# EAGLE design leg bridge (EAGLE 9.6.2)
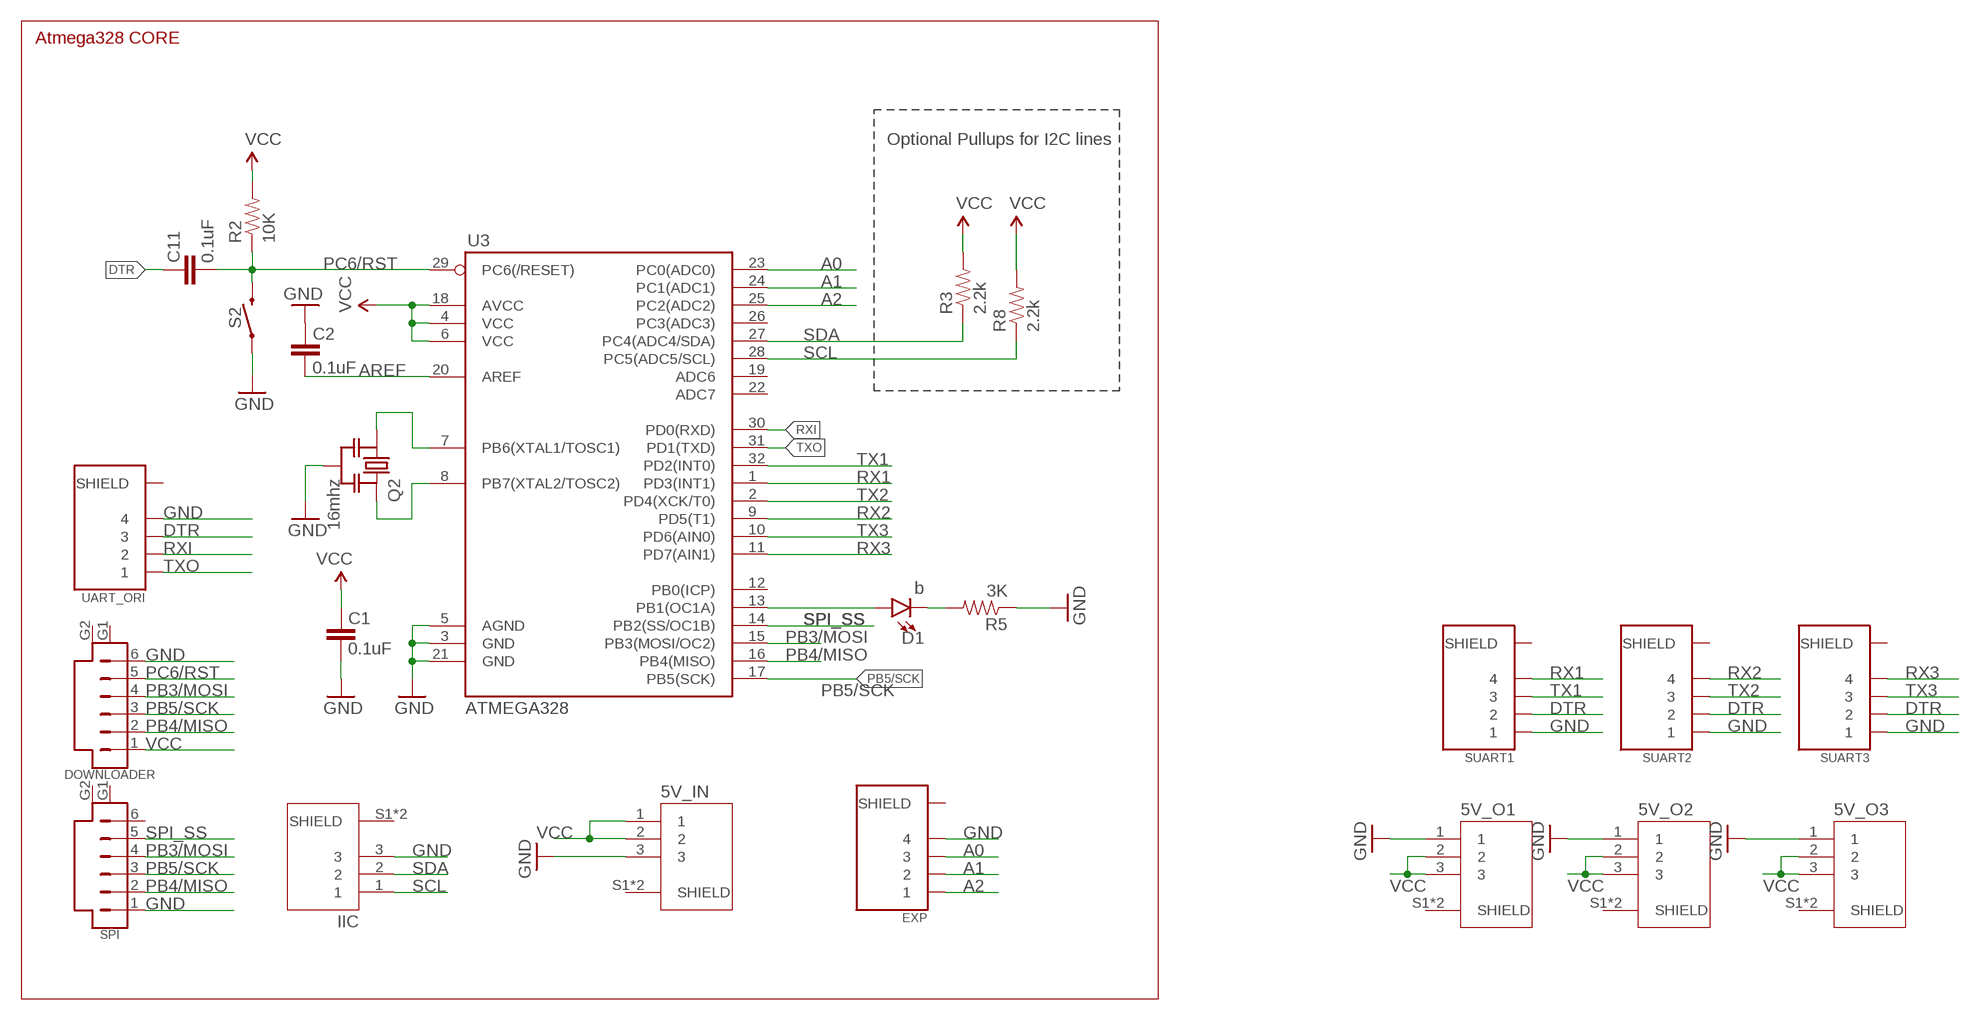
[diagram p0: schematic, sheet 1]

## Parts
5V_IN  SM03B-SRSS-TB(LF)(SN)  [JST_SM03B-SRSS-TB(LF)(SN)]
5V_O1  SM03B-SRSS-TB(LF)(SN)  [JST_SM03B-SRSS-TB(LF)(SN)]
5V_O2  SM03B-SRSS-TB(LF)(SN)  [JST_SM03B-SRSS-TB(LF)(SN)]
5V_O3  SM03B-SRSS-TB(LF)(SN)  [JST_SM03B-SRSS-TB(LF)(SN)]
C1  0.1uF  CAP0603-CAP  [0603-CAP]
C2  0.1uF  CAP0603-CAP  [0603-CAP]
C11  0.1uF  CAP0603-CAP  [0603-CAP]
D1  b  LED0603  [LED-0603]
DOWNLOADER  SM06B-SRSS-TB  [SM06B]
EXP  SM04B-SRSS-TB(LF)(SN)  [JST_SM04B-SRSS-TB(LF)(SN)]
IIC  SM03B-SRSS-TB(LF)(SN)  [JST_SM03B-SRSS-TB(LF)(SN)]
Q2  16mhz  RESONATOR-MURATACST_CE  [RESONATOR_MURATA2]
R2  10K  RESISTOR0603-RES  [0603-RES]
R3  2.2k  RESISTOR0603-RES  [0603-RES]
R5  3K  RESISTOR0603-RES  [0603-RES]
R8  2.2k  RESISTOR0603-RES  [0603-RES]
S2  MOMENTARY-SWITCH-SPST-SMD-RIGHT-ANGLE  [TACTILE_SWITCH_SMD_RIGHT_ANGLE]
SPI  SM06B-SRSS-TB  [SM06B]
SUART1  SM04B-SRSS-TB(LF)(SN)  [JST_SM04B-SRSS-TB(LF)(SN)]
SUART2  SM04B-SRSS-TB(LF)(SN)  [JST_SM04B-SRSS-TB(LF)(SN)]
SUART3  SM04B-SRSS-TB(LF)(SN)  [JST_SM04B-SRSS-TB(LF)(SN)]
U3  ATMEGA328  ATMEGA168  [TQFP32-08]
UART_ORI  SM04B-SRSS-TB(LF)(SN)  [JST_SM04B-SRSS-TB(LF)(SN)]

## Nets
A0: EXP.3 U3.23(PC0(ADC0))
A1: EXP.2 U3.24(PC1(ADC1))
A2: EXP.1 U3.25(PC2(ADC2))
AREF: C2.1 U3.20(AREF)
DTR: C11.2 SUART1.2 SUART2.2 SUART3.2 UART_ORI.3
GND: 5V_IN.3 5V_O1.1 5V_O2.1 5V_O3.1 C1.1 C2.2 DOWNLOADER.6 EXP.4 IIC.3 Q2.2 R5.1 S2.1 SPI.1 SUART1.1 SUART2.1 SUART3.1 U3.3(GND) U3.5(AGND) U3.21(GND) UART_ORI.4
N$1: Q2.1 U3.7(PB6(XTAL1/TOSC1))
N$2: Q2.3 U3.8(PB7(XTAL2/TOSC2))
N$3: D1.A U3.13(PB1(OC1A))
N$7: D1.C R5.2
PB3/MOSI: DOWNLOADER.4 SPI.4 U3.15(PB3(MOSI/OC2))
PB4/MISO: DOWNLOADER.2 SPI.2 U3.16(PB4(MISO))
PB5/SCK: DOWNLOADER.3 SPI.3 U3.17(PB5(SCK))
PC6/RST: C11.1 DOWNLOADER.5 R2.1 S2.2 U3.29(PC6(/RESET))
RX1: SUART1.4 U3.1(PD3(INT1))
RX2: SUART2.4 U3.9(PD5(T1))
RX3: SUART3.4 U3.11(PD7(AIN1))
RXI: U3.30(PD0(RXD)) UART_ORI.2
SCL: IIC.1 R8.1 U3.28(PC5(ADC5/SCL))
SDA: IIC.2 R3.1 U3.27(PC4(ADC4/SDA))
SPI_SS: SPI.5 U3.14(PB2(SS/OC1B))
TX1: SUART1.3 U3.32(PD2(INT0))
TX2: SUART2.3 U3.2(PD4(XCK/T0))
TX3: SUART3.3 U3.10(PD6(AIN0))
TXO: U3.31(PD1(TXD)) UART_ORI.1
VCC: 5V_IN.1 5V_IN.2 5V_O1.2 5V_O1.3 5V_O2.2 5V_O2.3 5V_O3.2 5V_O3.3 C1.2 DOWNLOADER.1 R2.2 R3.2 R8.2 U3.4(VCC) U3.6(VCC) U3.18(AVCC)
Unconnected: 5V_IN.S1(SHIELD) 5V_IN.S2(SHIELD) 5V_O1.S1(SHIELD) 5V_O1.S2(SHIELD) 5V_O2.S1(SHIELD) 5V_O2.S2(SHIELD) 5V_O3.S1(SHIELD) 5V_O3.S2(SHIELD) DOWNLOADER.G1 DOWNLOADER.G2 EXP.S1(SHIELD) EXP.S2(SHIELD) IIC.S1(SHIELD) IIC.S2(SHIELD) SPI.6 SPI.G1 SPI.G2 SUART1.S1(SHIELD) SUART1.S2(SHIELD) SUART2.S1(SHIELD) SUART2.S2(SHIELD) SUART3.S1(SHIELD) SUART3.S2(SHIELD) U3.12(PB0(ICP)) U3.19(ADC6) U3.22(ADC7) U3.26(PC3(ADC3)) UART_ORI.S1(SHIELD) UART_ORI.S2(SHIELD)

## Notes on the sheet
- Atmega328 CORE
- Optional Pullups for I2C lines

## Library data of the parts
5V_IN 5V_O1-5V_O3 IIC = SM03B-SRSS-TB_LF__SN_:SM03B-SRSS-TB(LF)(SN): SH Series 3 Position 1 mm Pitch Surface Mount Side Entry Shrouded Header; AVAILABILITY: Unavailable; DESCRIPTION: Connector Header Surface Mount, Right Angle 3 position 0.039 _1.00mm_; MF: JST Sales; MP: SM03B-SRSS-TB_LF__SN_; PACKAGE: None; PRICE: None
C1 C2 C11 = SparkFun:CAP: Capacitor Standard 0603 ceramic capacitor, and 0.1" leaded capacitor.
D1 = SparkFun-LED:LED: LED (Generic) Standard schematic elements and footprints for 5mm, 3mm, 1206, and 0603 sized LEDs. Generic LEDs with no color specified.
DOWNLOADER SPI = SM06B-SRSS-TB:SM06B-SRSS-TB: CONN HEADER SH 6POS SIDE 1MM TIN Check prices <https://snapeda.com/parts/SM06B-SRSS-TB/JST%20Sales/view-part/?ref=eda>; AVAILABILITY: Bad; DESCRIPTION: Connector Header Surface Mount, Right Angle 6 position 0.039 (1.00mm); MF: JST Sales; MP: SM06B-SRSS-TB; PACKAGE: None; PRICE: None
EXP SUART1-SUART3 UART_ORI = SM04B-SRSS-TB_LF__SN_:SM04B-SRSS-TB(LF)(SN): SH Series 1.0 mm Pitch 2 Position Single Row Side Entry Shrouded Header Check prices <https://snapeda.com/parts/SM04B-SRSS-TB%28LF%29%28SN%29/JST%20Sales/view-part/?ref=eda>; ARROW_EUROPE-PURCHASE-URL: https://snapeda.com/shop?store=Arrow+Europe&id=557466; AVAILABILITY: Good; DESCRIPTION: Connector Header Surface Mount, Right Angle 4 position 0.039 (1.00mm); DIGIKEY-PURCHASE-URL: https://snapeda.com/shop?store=DigiKey&id=557466; MF: JST Sales; MP: SM04B-SRSS-TB(LF)(SN); PACKAGE: None; PRICE: None
Q2 = m-pad-2.1:RESONATOR-MURATA: Murata ceramic Resonator "ceralock" CSTCE series with built in load capacitance +- 0.5% tolerance 12.51MHz to 19.99MHz 16MHz murata part#: CSTCE16M0V53-R0 16MHz digikey part#: 490-1198-1-ND $1.33 each
R2 R3 R5 R8 = SparkFun:RESISTOR: Resistor Basic schematic elements and footprints for 0603, 1206, and PTH resistors.
S2 = SparkFun-Switches:MOMENTARY-SWITCH-SPST: Momentary Switch (Pushbutton) - SPST Normally-open (NO) SPST momentary switches (buttons, pushbuttons). Variants PTH-12MM - 12mm square, through-hole Momentary Pushbutton Switch - 12mm Square <https://www.sparkfun.com/products/9190> (COM-09190) PTH-6.0MM, PTH-6.0MM-KIT - 6.0mm square, through-hole Mini Pushbutton Switch <https://www.sparkfun.com/products/97> (COM-00097) KIT package intended for soldering kit's - only one side of pads' copper is exposed. PTH-RIGHT-ANGLE-KIT - Right-angle, through-hole Right Angle Tactile Button <https://www.sparkfun.com/products/10791> - Used on SparkFun BigTime Watch Kit <https://www.sparkfun.com/products/11734> SMD-12MM - 12mm square, surface-mount Tactile Button - SMD (12mm) <https://www.sparkfun.com/products/12993> (COM-12993) Used on SparkFun PicoBoard <https://www.sparkfun.com/products/11888> SMD-4.5MM - 4.5mm Square Trackball Switch Used on SparkFun Blackberry Trackballer Breakout <https://www.sparkfun.com/products/13169> SMD-4.6MMX2.8MM - 4.60mm x 2.80mm, surface mount Used on SparkFun SAMD21 Mini Breakout <https://www.sparkfun.com/products/13664> SMD-5.2MM, SMD-5.2-REDUNDANT - 5.2mm square, surface-mount Mini Pushbutton Switch - SMD <https://www.sparkfun.com/products/8720> (COM-08720) Used on Arduino Pro Mini <https://www.sparkfun.com/products/11114> REDUNDANT package connects both switch circuits together SMD-6.0X3.5MM - 6.0 x 3.5mm, surface mount Momentary Reset Switch SMD <https://www.sparkfun.com/products/8229> (COM-08229) SMD-6.2MM-TALL - 6.2mm square, surface mount Tactile Button - SMD (6mm) <https://www.sparkfun.com/products/12992> Used on SparkFun Digital Sandbox <https://www.sparkfun.com/products/12651> SMD-RIGHT-ANGLE - Right-angle, surface mount Used on SparkFun Block for Intel® Edison - Arduino <https://www.sparkfun.com/products/13036>; PROD_ID: COMP-12265
U3 = SparkFun:ATMEGA168

## Net classes
0 default: width 0.203 mm
1 vcc: width 0.254 mm

## Board
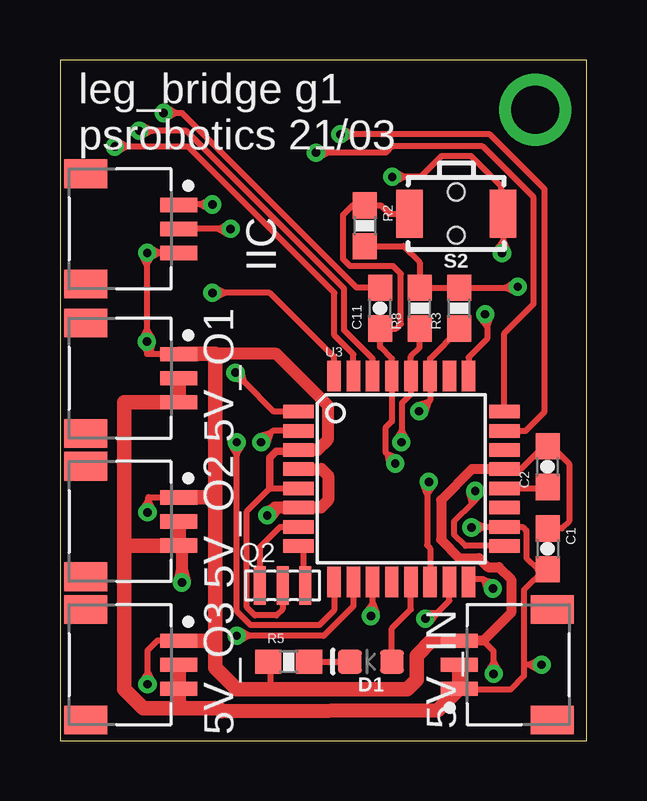
[diagram p1: board, top side]
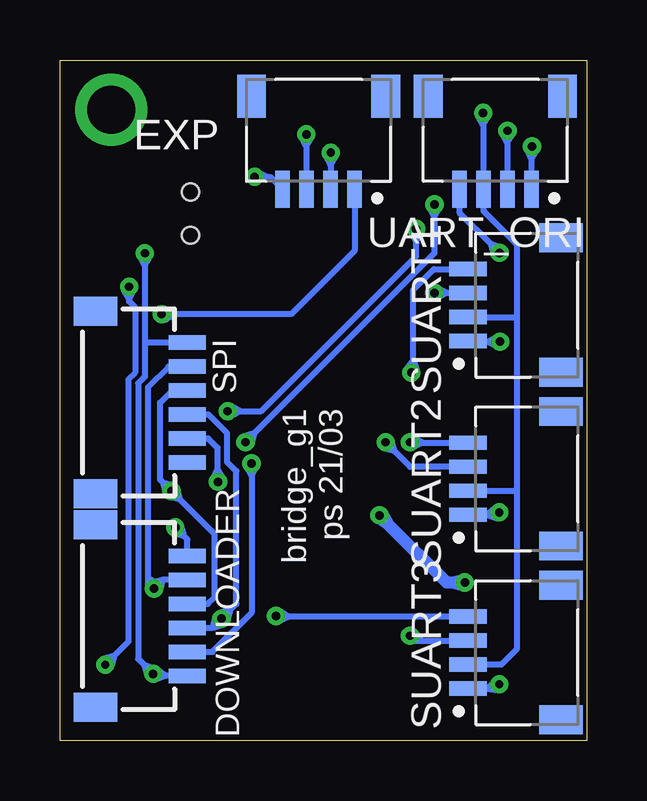
[diagram p2: board, bottom side, seen from below]

Size 21.95 x 28.37 mm. Coordinates in mm from the lower left corner, seen from the top.
Outline: 0,0 21.95,0 21.95,28.37 0,28.37 0,0
Copper layers (1*16): Top 0.035mm / dielectric 1.5mm / Bottom 0.035mm
Design rules "default *": minimum track width 6mil, minimum drill 0.35mm, track to track 6mil, track to pad 6mil, pad to pad 6mil, via to via 6mil, smd to smd 6mil, copper to edge 5mil, drill to drill 6mil, minimum pad ring 10mil, minimum via ring 8mil, stop-mask expansion 4mil, vias tented up to drill 20mil, thermal gap 10mil

### Footprints (pad centres in the part's own frame; a part is rotated, then mirrored left to right if it is on the bottom)
JST_SM03B-SRSS-TB(LF)(SN) = smd 0.6 x 1.55: 1 -1,0; 2 0,0; 3 1,0 | smd 1.2 x 1.8: S1 -2.3,-3.875; S2 2.3,-3.875
0603-CAP = smd 1.1 x 1: 1 -0.85,0; 2 0.85,0
LED-0603 = smd 1 x 1: A -0.877,0; C 0.877,0
SM06B = smd 0.6 x 1.55: 1 -2.5,2.275; 2 -1.5,2.275; 3 -0.5,2.275; 4 0.5,2.275; 5 1.5,2.275; 6 2.5,2.275 | smd 1.2 x 1.8: G1 -3.8,-1.55; G2 3.8,-1.55
JST_SM04B-SRSS-TB(LF)(SN) = smd 0.6 x 1.55: 1 -1.5,0; 2 -0.5,0; 3 0.5,0; 4 1.5,0 | smd 1.2 x 1.8: S1 -2.8,-3.875; S2 2.8,-3.875
RESONATOR_MURATA2 = smd 0.5 x 1.6: 1 -0.95,0; 2 0,0; 3 0.95,0
0603-RES = smd 1.1 x 1: 1 -0.85,0; 2 0.85,0
TACTILE_SWITCH_SMD_RIGHT_ANGLE = smd 1.1 x 2: 1 -1.95,0; 2 1.95,0 | hole 0.7: 0,0.9; 0,-0.9
TQFP32-08 = smd 1.27 x 0.559: 1 -4.293,2.8; 2 -4.293,2; 3 -4.293,1.2; 4 -4.293,0.4; 5 -4.293,-0.4; 6 -4.293,-1.2; 7 -4.293,-2; 8 -4.293,-2.8; 17 4.293,-2.8; 18 4.293,-2; 19 4.293,-1.2; 20 4.293,-0.4; 21 4.293,0.4; 22 4.293,1.2; 23 4.293,2; 24 4.293,2.8 | smd 0.559 x 1.27: 9 -2.8,-4.293; 10 -2,-4.293; 11 -1.2,-4.293; 12 -0.4,-4.293; 13 0.4,-4.293; 14 1.2,-4.293; 15 2,-4.293; 16 2.8,-4.293; 25 2.8,4.293; 26 2,4.293; 27 1.2,4.293; 28 0.4,4.293; 29 -0.4,4.293; 30 -1.2,4.293; 31 -2,4.293; 32 -2.8,4.293

### Placement (x,y rotation side)
5V_IN  16.64,3.17 90 top
5V_O1  4.95,15.11 270 top
5V_O2  4.95,9.14 270 top
5V_O3  4.95,3.17 270 top
C1  20.32,8 270 top
C2  20.32,11.43 90 top
C11  13.34,18.03 90 top
D1  12.95,3.3 180 top
DOWNLOADER  18.92,5.21 270 bottom
EXP  11.18,22.99 180 bottom
IIC  4.95,21.34 270 top
Q2  9.27,6.48 0 top
R2  12.7,21.46 270 top
R3  16.64,18.03 90 top
R5  9.53,3.3 0 top
R8  14.99,18.03 90 top
S2  16.51,21.97 180 top
SPI  18.92,14.1 270 bottom
SUART1  4.95,18.16 90 bottom
SUART2  4.95,10.92 90 bottom
SUART3  4.95,3.68 90 bottom
U3  14.22,10.92 0 top
UART_ORI  3.81,22.99 180 bottom

### Tracks (layer width: path | path; a pad name or v marks a point on that pad's centre or on a via)
A0  (via drill 0.35)
  Top 0.254: U3.23 19.4,12.92 20.19,13.72 20.19,22.99 17.91,25.27 12.21,25.27 | 12.21,25.27 v11.68,25.27 | 12.21,25.27 11.8,25.49 | 11.8,25.49 | v11.68,25.27 11.8,25.49 | 12.21,25.27 11.8,25.05 | v11.68,25.27 11.8,25.05 | 12.21,25.27 11.8,25.49 | v11.68,25.27 11.8,25.49 | 12.21,25.27 11.8,25.05 | v11.68,25.27 11.8,25.05
  Bottom 0.254: v11.68,25.27 11.68,24.75 | 11.68,24.75 EXP.3 | 11.68,24.75 11.9,25.15 | 11.9,25.15 | v11.68,25.27 11.9,25.15 | 11.68,24.75 11.46,25.15 | v11.68,25.27 11.46,25.15 | 11.68,24.75 11.9,25.15 | v11.68,25.27 11.9,25.15 | 11.68,24.75 11.46,25.15 | v11.68,25.27 11.46,25.15
A1  (via drill 0.35)
  Top 0.254: U3.24 18.52,16.99 19.73,18.21 19.73,22.65 17.61,24.77 13.85,24.77 13.59,24.51 11.19,24.51 | 11.19,24.51 v10.67,24.51 | 11.19,24.51 10.79,24.73 | 10.79,24.73 | v10.67,24.51 10.79,24.73 | 11.19,24.51 10.79,24.29 | v10.67,24.51 10.79,24.29 | 11.19,24.51 10.79,24.73 | v10.67,24.51 10.79,24.73 | 11.19,24.51 10.79,24.29 | v10.67,24.51 10.79,24.29
  Bottom 0.254: v10.67,24.51 v10.68,24.5 10.68,23.99 | 10.68,23.99 EXP.2 | 10.68,23.99 10.89,24.39 v10.67,24.51 | 10.68,23.99 10.45,24.39 v10.67,24.51
A2  (via drill 0.35)
  Top 0.254: v17.72,17.78 17.8,17.7 17.8,17.26 | 17.8,17.26 17.8,16.75 17.02,15.98 U3.25 | 17.8,17.26 17.95,17.7 v17.72,17.78 | 17.8,17.26 17.52,17.63 v17.72,17.78
  Bottom 0.254: EXP.1 9.68,20.42 12.32,17.78 17.13,17.78 | 17.13,17.78 17.19,17.78 | 17.19,17.78 v17.72,17.78 | 17.13,17.78 17.19,17.75 | 17.19,17.75 17.53,17.56 17.58,17.53 17.6,17.56 | 17.13,17.78 17.19,17.82 | 17.19,17.82 17.58,18.03 17.6,18 | 17.19,17.78 17.6,17.56 | v17.72,17.78 17.6,17.56 | 17.19,17.78 17.6,18 | v17.72,17.78 17.6,18 | 17.19,17.75 17.61,17.55 v17.72,17.78 | 17.19,17.75 17.58,17.99 v17.72,17.78 | 17.19,17.82 17.58,17.57 v17.72,17.78 | 17.19,17.82 17.61,18.01 v17.72,17.78
AREF
  Top 0.254: U3.20 20.26,10.52 C2.1
DTR  (via drill 0.35)
  Top 0.254: C11.2 12.36,18.88 5.09,26.16 4.84,26.16 | 4.84,26.16 v4.32,26.16 | 4.84,26.16 4.44,26.38 | 4.44,26.38 | v4.32,26.16 4.44,26.38 | 4.84,26.16 4.44,25.94 | v4.32,26.16 4.44,25.94 | 4.84,26.16 4.44,26.38 | v4.32,26.16 4.44,26.38 | 4.84,26.16 4.44,25.94 | v4.32,26.16 4.44,25.94
  Bottom 0.254: v4.32,26.16 4.32,25.64 | 4.32,25.64 UART_ORI.3 4.31,22.09 2.92,20.7 2.92,17.65 | 2.92,17.65 2.92,10.41 | 2.92,10.41 2.92,3.81 3.56,3.17 SUART3.2 | SUART2.2 2.93,10.42 2.92,10.41 | SUART1.2 2.93,17.66 2.92,17.65 | 4.32,25.64 4.54,26.04 | 4.54,26.04 | v4.32,26.16 4.54,26.04 | 4.32,25.64 4.1,26.04 | v4.32,26.16 4.1,26.04 | 4.32,25.64 4.54,26.04 | v4.32,26.16 4.54,26.04 | 4.32,25.64 4.1,26.04 | v4.32,26.16 4.1,26.04
GND  (via drill 0.35)
  Top 0.254: C1.1 20.92,8.85 21.21,9.14 21.21,11.56 20.49,12.28 C2.2 20.15,12.28 19.2,11.32 U3.21 | Q2.2 9.27,5.49 9.02,5.23 8.12,5.23 7.79,5.56 7.79,9.57 8.74,10.52 U3.5 | R5.1 8.76,3.21 8.76,2.16 | v18.07,2.79 18.07,3.32 | 18.07,3.32 18.07,3.74 17.64,4.17 | 14.37,23.5 15.03,23.5 15.89,24.36 17.13,24.36 18.38,23.11 18.38,22.05 S2.1 18.46,20.84 | 14.37,23.5 v13.84,23.5 | 18.46,20.84 18.46,20.36 v18.41,20.32 | v3.62,16.64 3.62,16.13 3.75,16.13 | 3.75,16.13 4.97,16.13 | v3.65,9.53 3.68,9.56 3.68,10.05 | 3.68,10.05 3.68,10.16 4.97,10.16 | v3.65,2.36 3.65,2.88 | 3.65,2.88 3.65,3.77 4.06,4.19 4.94,4.19 5V_O3.1 | 3.62,19.81 3.62,20.34 v3.63,20.34 | 3.62,19.81 3.62,17.16 | 3.62,17.16 v3.62,16.64 | IIC.3 4.16,20.34 | 4.16,20.34 v3.63,20.34 | 18.07,3.32 | 18.07,3.32 | 18.07,3.32 18.29,2.91 | 18.07,3.32 17.85,2.91 | 17.85,2.91 | v18.07,2.79 17.85,2.91 | 18.07,3.32 18.29,2.91 | v18.07,2.79 18.29,2.91 | 18.07,3.32 17.85,2.91 | v18.07,2.79 17.85,2.91 | 18.07,3.32 18.29,2.91 | v18.07,2.79 18.29,2.91 | 14.37,23.5 13.96,23.72 | 13.96,23.72 | v13.84,23.5 13.96,23.72 | 14.37,23.5 13.96,23.28 | v13.84,23.5 13.96,23.28 | 14.37,23.5 13.96,23.72 | v13.84,23.5 13.96,23.72 | 14.37,23.5 13.96,23.28 | v13.84,23.5 13.96,23.28 | 18.46,20.84 18.21,20.46 v18.41,20.32 | 18.46,20.84 18.64,20.42 v18.41,20.32 | 3.62,17.16 | 3.62,17.16 | 3.62,17.16 3.84,16.76 | 3.75,16.13 3.86,16.58 v3.62,16.64 | 3.75,16.13 3.44,16.46 v3.62,16.64 | 3.62,17.16 3.4,16.76 | 3.4,16.76 | v3.62,16.64 3.4,16.76 | 3.62,17.16 3.84,16.76 | v3.62,16.64 3.84,16.76 | 3.62,17.16 3.4,16.76 | v3.62,16.64 3.4,16.76 | 3.62,17.16 3.84,16.76 | v3.62,16.64 3.84,16.76 | 3.68,10.05 3.44,9.66 v3.65,9.53 | 3.68,10.05 3.88,9.63 v3.65,9.53
  Top 0.254: 3.65,2.88 | 3.65,2.88 | 3.65,2.88 3.87,2.48 | 3.65,2.88 3.43,2.48 | 3.43,2.48 | v3.65,2.36 3.43,2.48 | 3.65,2.88 3.87,2.48 | v3.65,2.36 3.87,2.48 | 3.65,2.88 3.43,2.48 | v3.65,2.36 3.43,2.48 | 3.65,2.88 3.87,2.48 | v3.65,2.36 3.87,2.48 | 3.62,19.81 3.85,20.21 v3.63,20.34 | 3.62,19.81 3.41,20.22 v3.63,20.34 | 4.16,20.34 3.76,20.56 | 3.76,20.56 | v3.63,20.34 3.76,20.56 | 4.16,20.34 3.76,20.11 | v3.63,20.34 3.76,20.11 | 4.16,20.34 3.76,20.56 | v3.63,20.34 3.76,20.56 | 4.16,20.34 3.76,20.11 | v3.63,20.34 3.76,20.11
  Top 0.305: U3.3 9.87,12.06 9.02,12.06 8.74,11.79 8.74,10.52
  Top 0.406: U3.21 17.16,11.32 15.88,10.03 15.88,8.38 16.64,7.62 17.45,7.62 17.83,7.24 18.29,7.24 18.8,6.73 18.8,5.33 17.64,4.17 5V_IN.3
  Top 0.508: U3.3 10.72,12.12 11.18,12.57 11.18,13.97 9.01,16.13 6.48,16.13
  Top 0.61: 5V_IN.3 15.48,4.17 14.86,3.56 14.86,2.54 14.48,2.16 8.76,2.16 7.37,2.16 6.48,3.05 6.48,4.19 | 6.48,4.19 6.48,10.16 | 6.48,10.16 6.48,16.13 4.97,16.13 5V_O1.1 | 5V_O2.1 4.97,10.16 6.48,10.16 | 5V_O3.1 6.46,4.17 6.48,4.19
  Bottom 0.254: DOWNLOADER.6 17.55,2.71 | 17.55,2.71 17.98,2.71 v18.07,2.79 | v13.84,23.5 13.32,23.5 | 13.32,23.5 13.19,23.5 EXP.4 | v18.41,20.32 18.41,19.8 | 18.41,19.8 18.41,16.51 | 18.41,16.51 18.41,15.18 18.69,14.9 18.69,3.42 18.44,3.17 | 18.44,3.17 v18.07,2.79 | SPI.1 18.33,16.6 18.41,16.51 | SUART1.1 4.93,16.64 4.14,16.64 | 4.14,16.64 v3.62,16.64 | SUART2.1 4.16,9.42 | 4.16,9.42 3.75,9.42 v3.65,9.53 | SUART3.1 4.14,2.18 | 4.14,2.18 3.82,2.18 v3.65,2.36 | UART_ORI.4 5.31,22.01 4.01,20.71 | 4.01,20.71 v3.63,20.34 | 17.55,2.71 17.99,2.56 v18.07,2.79 | 17.55,2.71 17.91,2.99 v18.07,2.79 | 18.44,3.17 18,3.04 v18.07,2.79 | 18.44,3.17 18.31,2.72 v18.07,2.79 | 13.32,23.5 | 13.32,23.5 | 13.32,23.5 13.72,23.72 | 13.32,23.5 13.72,23.28 | 13.72,23.28 | v13.84,23.5 13.72,23.28 | 13.32,23.5 13.72,23.72 | v13.84,23.5 13.72,23.72 | 13.32,23.5 13.72,23.28 | v13.84,23.5 13.72,23.28 | 13.32,23.5 13.72,23.72 | v13.84,23.5 13.72,23.72 | 18.41,19.8 18.64,20.2 | 18.64,20.2 | v18.41,20.32 18.64,20.2 | 18.41,19.8 18.19,20.2 | v18.41,20.32 18.19,20.2 | 18.41,19.8 18.64,20.2 | v18.41,20.32 18.64,20.2 | 18.41,19.8 18.19,20.2 | v18.41,20.32 18.19,20.2 | 4.14,16.64 3.74,16.86 | 3.74,16.86 | v3.62,16.64 3.74,16.86 | 4.14,16.64 3.74,16.42 | v3.62,16.64 3.74,16.42 | 4.14,16.64 3.74,16.86 | v3.62,16.64 3.74,16.86 | 4.14,16.64 3.74,16.42 | v3.62,16.64 3.74,16.42 | 4.16,9.42 3.81,9.72 | v3.65,9.53 3.81,9.72 | 4.16,9.42 3.72,9.29 | v3.65,9.53 3.72,9.29 | 4.16,9.42 3.81,9.72 | v3.65,9.53 3.81,9.72 | 4.16,9.42 3.72,9.29 | v3.65,9.53 3.72,9.29 | 4.14,2.18 3.83,2.53 v3.65,2.36 | 4.14,2.18 3.69,2.11 v3.65,2.36 | 4.01,20.71 3.56,20.58 v3.63,20.34 | 4.01,20.71 3.88,20.27 v3.63,20.34
N$1
  Top 0.254: Q2.1 8.32,8.07 9.18,8.92 U3.7
N$2
  Top 0.254: Q2.3 10.16,6.54 10.16,7.89 U3.8
N$3
  Top 0.254: D1.A 13.83,4.69 14.62,5.48 U3.13
N$4  (via drill 2)
  other vias: 19.81,26.29
N$7
  Top 0.254: R5.2 D1.C
PB3/MOSI  (via drill 0.35)
  Top 0.254: 15.7,5.32 16.22,5.84 U3.15 | 15.7,5.32 15.48,5.1 v15.22,5.1 | 15.7,5.32 | 15.7,5.32 | 15.7,5.32 15.43,4.95 | 15.7,5.32 15.24,5.35 | 15.24,5.35 | v15.22,5.1 15.24,5.35 | 15.7,5.32 15.43,4.95 | v15.22,5.1 15.43,4.95 | 15.7,5.32 15.24,5.35 | v15.22,5.1 15.24,5.35 | 15.7,5.32 15.43,4.95 | v15.22,5.1 15.43,4.95
  Bottom 0.254: DOWNLOADER.4 15.61,4.71 15.6,4.72 | 15.6,4.72 v15.22,5.1 | 14.85,5.47 14.61,5.71 14.61,11.24 14.99,11.62 14.99,12.83 15.76,13.6 SPI.4 | 14.85,5.47 v15.22,5.1 | 15.6,4.72 15.46,5.17 v15.22,5.1 | 15.6,4.72 15.15,4.86 v15.22,5.1 | 14.85,5.47 14.98,5.03 v15.22,5.1 | 14.85,5.47 15.29,5.34 v15.22,5.1
PB4/MISO  (via drill 0.35)
  Top 0.254: U3.16 17.13,6.73 17.65,6.73 17.66,6.72 | v18.03,6.35 17.66,6.72 | 17.66,6.72 17.79,6.28 v18.03,6.35 | 17.66,6.72 18.11,6.59 v18.03,6.35
  Bottom 0.254: DOWNLOADER.2 16.67,6.73 17.65,6.73 17.66,6.72 | v18.03,6.35 17.66,6.72 | SPI.2 17.42,15.6 18.29,14.73 18.29,6.81 | 18.29,6.81 18.29,6.6 v18.03,6.35 | 17.66,6.72 17.79,6.28 v18.03,6.35 | 17.66,6.72 18.11,6.59 v18.03,6.35 | 18.29,6.81 17.9,6.56 v18.03,6.35 | 18.29,6.81 18.29,6.35 v18.03,6.35
PB5/SCK  (via drill 0.35)
  Top 0.254: U3.17 16.9,8.12 16.41,8.61 16.41,9.14 17.18,9.9 | v17.3,10.41 17.3,10.03 17.18,9.9 | 17.18,9.9 17.49,10.24 | v17.3,10.41 17.49,10.24 | 17.18,9.9 17.06,10.35 | v17.3,10.41 17.06,10.35 | 17.18,9.9 17.49,10.24 | v17.3,10.41 17.49,10.24 | 17.18,9.9 17.06,10.35 | v17.3,10.41 17.06,10.35
  Bottom 0.254: v17.3,10.41 16.93,10.04 | 16.93,10.04 15.53,8.64 15.53,5.97 15.79,5.71 DOWNLOADER.3 | v17.3,10.41 17.68,10.79 | 17.68,10.79 17.78,10.89 17.78,14.1 17.28,14.6 SPI.3 | 16.93,10.04 17.37,10.17 v17.3,10.41 | 16.93,10.04 17.06,10.48 v17.3,10.41 | 17.68,10.79 17.23,10.65 v17.3,10.41 | 17.68,10.79 17.54,10.34 v17.3,10.41
PC6/RST  (via drill 0.35)
  Top 0.254: S2.2 13.72,21.97 13.37,22.31 R2.1 12.19,22.31 11.79,21.91 11.79,20.07 12.08,19.78 13.88,19.78 14.21,19.46 14.21,17.38 14.01,17.18 C11.1 13.34,16.42 13.82,15.93 U3.29 13.82,13.31 13.56,13.04 13.56,12.03 13.63,11.96 | v13.97,11.56 13.97,11.62 13.63,11.96 | 13.63,11.96 | 13.63,11.96 | 13.63,11.96 14.06,11.79 | 13.63,11.96 13.72,11.51 | 13.72,11.51 | v13.97,11.56 13.72,11.51 | 13.63,11.96 | 13.63,11.96 14.06,11.79 | 14.06,11.79 | 13.63,11.96 13.72,11.51 | v13.97,11.56 13.72,11.51 | 13.63,11.96 14.06,11.79 | v13.97,11.56 14.06,11.79
  Bottom 0.254: DOWNLOADER.5 15.6,3.71 13.97,5.33 13.97,11.03 | v13.97,11.56 13.97,11.03 | 13.97,11.03 14.19,11.44 | 14.19,11.44 | v13.97,11.56 14.19,11.44 | 13.97,11.03 13.75,11.44 | v13.97,11.56 13.75,11.44 | 13.97,11.03 14.19,11.44 | v13.97,11.56 14.19,11.44 | 13.97,11.03 13.75,11.44 | v13.97,11.56 13.75,11.44
RX1  (via drill 0.35)
  Top 0.254: U3.1 8.91,13.72 7.67,14.96 | v7.31,15.34 7.31,15.32 7.67,14.96 | 7.67,14.96 7.55,15.41 v7.31,15.34 | 7.67,14.96 7.24,15.11 v7.31,15.34
  Bottom 0.254: v7.31,15.34 7.24,15.42 7.24,15.86 | 7.24,15.86 7.24,18.8 6.37,19.66 SUART1.4 | 7.24,15.86 7.08,15.43 v7.31,15.34 | 7.24,15.86 7.51,15.49 v7.31,15.34
RX2  (via drill 0.35)
  Top 0.254: U3.9 11.42,5.46 10.79,4.83 7.94,4.83 7.37,5.4 7.37,11.92 | 7.37,11.92 v7.37,12.45 | 7.37,11.92 7.59,12.33 | 7.59,12.33 | v7.37,12.45 7.59,12.33 | 7.37,11.92 7.14,12.33 | v7.37,12.45 7.14,12.33 | 7.37,11.92 7.59,12.33 | v7.37,12.45 7.59,12.33 | 7.37,11.92 7.14,12.33 | v7.37,12.45 7.14,12.33
  Bottom 0.254: v7.37,12.45 7.34,12.42 6.84,12.42 | 6.84,12.42 SUART2.4 | 6.84,12.42 7.26,12.22 v7.37,12.45 | 6.84,12.42 7.24,12.66 v7.37,12.45
RX3  (via drill 0.35)
  Top 0.254: v12.95,5.21 13.02,5.28 13.02,5.73 | 13.02,5.73 U3.11 | 13.02,5.73 12.75,5.36 v12.95,5.21 | 13.02,5.73 13.19,5.3 v12.95,5.21
  Bottom 0.254: SUART3.4 12.43,5.18 | 12.43,5.18 12.93,5.18 v12.95,5.21 | 12.43,5.18 12.84,4.98 v12.95,5.21 | 12.43,5.18 12.82,5.42 v12.95,5.21
RXI  (via drill 0.35)
  Top 0.254: U3.30 13.02,15.93 11.84,17.12 11.84,18.84 5.25,25.42 3.83,25.42 | 3.83,25.42 v3.3,25.42 | 3.83,25.42 3.42,25.64 | 3.42,25.64 | v3.3,25.42 3.42,25.64 | 3.83,25.42 3.42,25.2 | v3.3,25.42 3.42,25.2 | 3.83,25.42 3.42,25.64 | v3.3,25.42 3.42,25.64 | 3.83,25.42 3.42,25.2 | v3.3,25.42 3.42,25.2
  Bottom 0.254: v3.3,25.42 3.3,25.04 3.31,25.03 3.31,24.9 | 3.31,24.9 UART_ORI.2 | 3.31,24.9 3.52,25.31 v3.3,25.42 | 3.31,24.9 3.08,25.3 v3.3,25.42
SCL  (via drill 0.35)
  Top 0.254: R8.1 14.99,16.38 14.62,16.02 U3.28 14.62,14.45 14.24,14.07 14.24,12.97 | 14.24,12.97 14.24,12.46 v14.22,12.45 | v6.35,22.35 5.83,22.35 | 5.83,22.35 4.97,22.35 IIC.1 | 14.24,12.97 14.01,12.57 v14.22,12.45 | 14.24,12.97 14.45,12.56 v14.22,12.45 | 5.83,22.35 | 5.83,22.35 | 5.83,22.35 6.23,22.57 | 5.83,22.35 6.23,22.13 | 6.23,22.13 | v6.35,22.35 6.23,22.13 | 5.83,22.35 6.23,22.57 | v6.35,22.35 6.23,22.57 | 5.83,22.35 6.23,22.13 | v6.35,22.35 6.23,22.13 | 5.83,22.35 6.23,22.57 | v6.35,22.35 6.23,22.57
  Bottom 0.254: v6.35,22.35 6.35,21.83 | 6.35,21.83 6.35,20.32 13.85,12.82 | v14.22,12.45 13.85,12.82 | 13.85,12.82 13.98,12.38 v14.22,12.45 | 13.85,12.82 14.29,12.69 v14.22,12.45 | 6.35,21.83 6.57,22.23 | 6.57,22.23 | v6.35,22.35 6.57,22.23 | 6.35,21.83 6.13,22.23 | v6.35,22.35 6.13,22.23 | 6.35,21.83 6.57,22.23 | v6.35,22.35 6.57,22.23 | 6.35,21.83 6.13,22.23 | v6.35,22.35 6.13,22.23
SDA  (via drill 0.35)
  Top 0.254: R3.1 16.64,17.14 15.42,15.93 U3.27 15.42,14.2 15.34,14.11 | 15.34,14.11 v14.97,13.74 | v7.11,21.34 6.59,21.34 | 6.59,21.34 IIC.2 | 15.34,14.11 14.89,13.98 v14.97,13.74 | 15.34,14.11 15.21,13.67 v14.97,13.74 | 6.59,21.34 | 6.59,21.34 | 6.59,21.34 6.99,21.56 | 6.59,21.34 6.99,21.11 | 6.99,21.11 | v7.11,21.34 6.99,21.11 | 6.59,21.34 6.99,21.56 | v7.11,21.34 6.99,21.56 | 6.59,21.34 6.99,21.11 | v7.11,21.34 6.99,21.11 | 6.59,21.34 6.99,21.56 | v7.11,21.34 6.99,21.56
  Bottom 0.254: v14.97,13.74 14.44,13.74 | 14.44,13.74 13.57,13.74 7.11,20.19 7.11,20.81 | 7.11,20.81 v7.11,21.34 | 14.44,13.74 | 14.44,13.74 | 14.44,13.74 14.85,13.96 | 14.44,13.74 14.85,13.52 | 14.85,13.52 | v14.97,13.74 14.85,13.52 | 14.44,13.74 14.85,13.96 | v14.97,13.74 14.85,13.96 | 14.44,13.74 14.85,13.52 | v14.97,13.74 14.85,13.52 | 14.44,13.74 14.85,13.96 | v14.97,13.74 14.85,13.96 | 7.11,20.81 7.33,21.22 | 7.33,21.22 | v7.11,21.34 7.33,21.22 | 7.11,20.81 6.89,21.22 | v7.11,21.34 6.89,21.22 | 7.11,20.81 7.33,21.22 | v7.11,21.34 7.33,21.22 | 7.11,20.81 6.89,21.22 | v7.11,21.34 6.89,21.22
SPI_SS  (via drill 0.35)
  Top 0.254: v15.37,10.79 15.3,10.72 15.3,10.28 | 15.3,10.28 15.3,8.15 15.42,8.03 U3.14 | 15.3,10.28 15.57,10.65 v15.37,10.79 | 15.3,10.28 15.13,10.71 v15.37,10.79
  Bottom 0.254: 15.39,11.32 15.39,12.22 15.77,12.6 SPI.5 | 15.39,11.32 15.39,10.82 v15.37,10.79 | 15.39,11.32 15.15,10.93 v15.37,10.79 | 15.39,11.32 15.59,10.9 v15.37,10.79
TX1  (via drill 0.35)
  Top 0.254: U3.32 11.42,15.98 8.73,18.67 6.88,18.67 | 6.88,18.67 v6.35,18.67 | 6.88,18.67 6.47,18.89 | 6.47,18.89 | v6.35,18.67 6.47,18.89 | 6.88,18.67 6.47,18.45 | v6.35,18.67 6.47,18.45 | 6.88,18.67 6.47,18.89 | v6.35,18.67 6.47,18.89 | 6.88,18.67 6.47,18.45 | v6.35,18.67 6.47,18.45
  Bottom 0.254: v6.35,18.67 5.83,18.67 | 5.83,18.67 4.96,18.67 SUART1.3 | 5.83,18.67 | 5.83,18.67 | 5.83,18.67 6.23,18.89 | 5.83,18.67 6.23,18.45 | 6.23,18.45 | v6.35,18.67 6.23,18.45 | 5.83,18.67 6.23,18.89 | v6.35,18.67 6.23,18.89 | 5.83,18.67 6.23,18.45 | v6.35,18.67 6.23,18.45 | 5.83,18.67 6.23,18.89 | v6.35,18.67 6.23,18.89
TX2  (via drill 0.35)
  Top 0.254: U3.2 8.86,12.92 8.75,12.82 | 8.75,12.82 v8.38,12.45 | 8.75,12.82 8.31,12.69 v8.38,12.45 | 8.75,12.82 8.62,12.38 v8.38,12.45
  Bottom 0.254: SUART2.3 7.36,11.42 8.01,12.07 | v8.38,12.45 8.01,12.07 | 8.01,12.07 8.45,12.21 v8.38,12.45 | 8.01,12.07 8.14,12.52 v8.38,12.45
TX3  (via drill 0.35)
  Top 0.254: U3.10 12.22,5.62 10.99,4.38 7.89,4.38 | 7.89,4.38 v7.37,4.38 | 7.89,4.38 7.49,4.6 | 7.49,4.6 | v7.37,4.38 7.49,4.6 | 7.89,4.38 7.49,4.16 | v7.37,4.38 7.49,4.16 | 7.89,4.38 7.49,4.6 | v7.37,4.38 7.49,4.6 | 7.89,4.38 7.49,4.16 | v7.37,4.38 7.49,4.16
  Bottom 0.254: v7.37,4.38 7.17,4.18 6.88,4.18 | 6.88,4.18 SUART3.3 | 6.88,4.18 7.34,4.13 v7.37,4.38 | 6.88,4.18 7.17,4.54 v7.37,4.38
TXO  (via drill 0.35)
  Top 0.254: U3.31 12.22,16.1 11.43,16.9 11.43,18.67 5.33,24.77 2.81,24.77 | 2.81,24.77 v2.29,24.77 | 2.81,24.77 2.41,24.99 | 2.41,24.99 | v2.29,24.77 2.41,24.99 | 2.81,24.77 2.41,24.54 | v2.29,24.77 2.41,24.54 | 2.81,24.77 2.41,24.99 | v2.29,24.77 2.41,24.99 | 2.81,24.77 2.41,24.54 | v2.29,24.77 2.41,24.54
  Bottom 0.254: v2.29,24.77 2.31,24.74 2.31,24.24 | 2.31,24.24 UART_ORI.1 | 2.31,24.24 2.51,24.66 v2.29,24.77 | 2.31,24.24 2.07,24.64 v2.29,24.77
VCC  (via drill 0.35)
  Top 0.254: R2.2 14.31,20.61 14.99,19.94 R8.2 R3.2 18.55,18.88 | v17.14,8.89 17.18,8.92 17.67,8.92 | 17.67,8.92 U3.18 19.27,8.92 19.43,8.76 19.43,7.62 19.9,7.15 C1.2 20.19,7.15 19.33,6.29 19.33,3.17 | 19.33,3.17 19.33,2.7 18.77,2.14 16.68,2.14 5V_IN.1 | 18.55,18.88 19.03,18.88 v19.07,18.92 | v20.07,3.17 19.54,3.17 | 19.54,3.17 19.33,3.17 | 17.67,8.92 17.25,9.12 v17.14,8.89 | 17.67,8.92 17.28,8.68 v17.14,8.89 | 18.55,18.88 18.97,18.69 v19.07,18.92 | 18.55,18.88 18.94,19.13 v19.07,18.92 | 19.54,3.17 | 19.54,3.17 | 19.54,3.17 19.95,3.4 | 19.54,3.17 19.95,2.95 | 19.95,2.95 | v20.07,3.17 19.95,2.95 | 19.54,3.17 19.95,3.4 | v20.07,3.17 19.95,3.4 | 19.54,3.17 19.95,2.95 | v20.07,3.17 19.95,2.95 | 19.54,3.17 19.95,3.4 | v20.07,3.17 19.95,3.4
  Top 0.406: 5.08,8.02 5V_O2.3
  Top 0.508: 9.05,9.72 U3.6 10.87,9.72 11.18,10.03 11.18,11.05 10.9,11.32 U3.4 | 9.05,9.72 8.96,9.72 v8.64,9.4 | 5.08,8.02 5.08,7.13 | 5.08,7.13 v5.08,6.6 | 9.05,9.72 8.59,9.51 v8.64,9.4 | 9.05,9.72 8.73,9.32 v8.64,9.4 | 5.08,7.13 4.96,6.63 | v5.08,6.6 4.96,6.63 | 5.08,7.13 5.2,6.63 | v5.08,6.6 5.2,6.63 | 5.08,7.13 4.96,6.63 | 5.08,7.13 5.2,6.63 | 5.08,7.13 4.96,6.63 | v5.08,6.6 4.96,6.63 | 5.08,7.13 5.2,6.63 | v5.08,6.6 5.2,6.63
  Top 0.61: 5V_O3.2 5V_O3.3 4.95,1.35 | 5V_O2.2 5V_O2.3 4.94,8.13 2.67,8.13 | 5V_O1.2 5V_O1.3 2.68,14.11 2.67,14.1 2.67,8.13 | 5V_IN.2 5V_IN.1 15.74,1.28 6.73,1.23 6.61,1.36 6.09,1.35 4.95,1.35 | 4.95,1.35 3.47,1.35 2.67,2.16 2.67,8.13
  Bottom 0.254: DOWNLOADER.1 16.65,8.39 16.77,8.52 | 16.77,8.52 v17.14,8.89 | v19.07,18.92 19.07,18.4 | 19.07,18.4 19.07,18.31 18.82,18.06 18.82,15.35 19.1,15.07 19.1,4.14 19.7,3.55 | 19.7,3.55 v20.07,3.17 | 16.77,8.52 17.22,8.65 v17.14,8.89 | 16.77,8.52 16.9,8.96 v17.14,8.89 | 19.07,18.4 19.29,18.8 | 19.29,18.8 | v19.07,18.92 19.29,18.8 | 19.07,18.4 18.85,18.8 | v19.07,18.92 18.85,18.8 | 19.07,18.4 19.29,18.8 | v19.07,18.92 19.29,18.8 | 19.07,18.4 18.85,18.8 | v19.07,18.92 18.85,18.8 | 19.7,3.55 19.82,3.1 v20.07,3.17 | 19.7,3.55 20.14,3.42 v20.07,3.17
  Bottom 0.508: v8.64,9.4 8.27,9.03 | 8.27,9.03 5.84,6.6 5.61,6.6 | 5.61,6.6 v5.08,6.6 | 8.27,9.03 8.7,9.29 v8.64,9.4 | 8.27,9.03 8.53,9.46 v8.64,9.4 | 5.61,6.6 5.11,6.72 | v5.08,6.6 5.11,6.72 | 5.61,6.6 5.11,6.48 | v5.08,6.6 5.11,6.48 | 5.61,6.6 5.11,6.72 | 5.61,6.6 5.11,6.48 | 5.61,6.6 5.11,6.72 | v5.08,6.6 5.11,6.72 | 5.61,6.6 5.11,6.48 | v5.08,6.6 5.11,6.48

### Text on the board
tPlace: leg_bridge g1 / psrobotics 21/03
bPlace: bridge_g1 / ps 21/03